# Altium schematic sheet Hammerhead - USB R1.1.SchDoc
size A; SheetNumber: 6
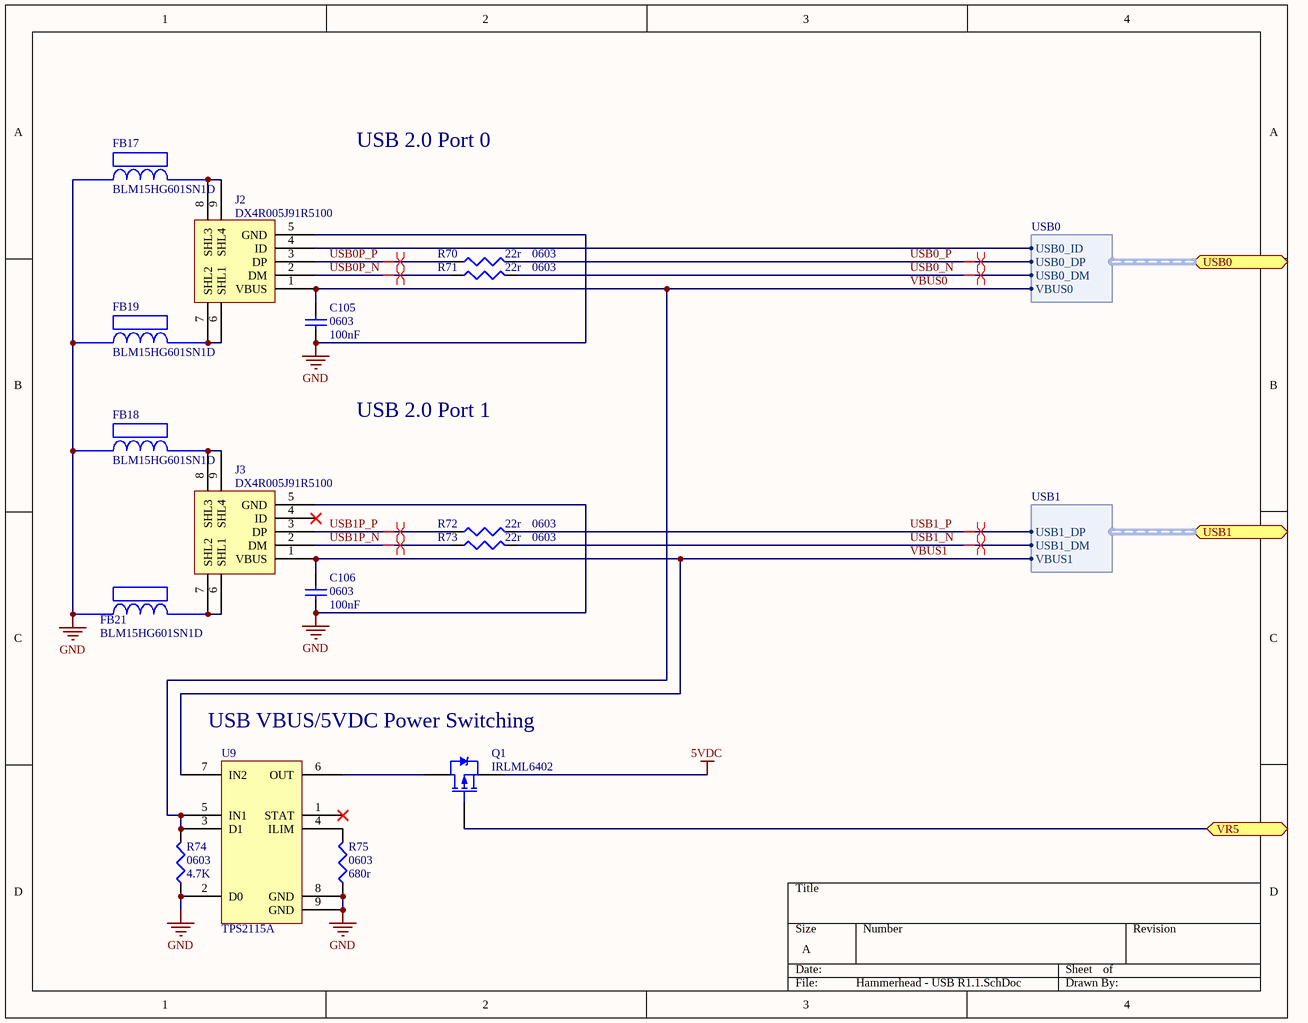
[diagram p0: Hammerhead - USB R1.1.SchDoc]

## Parts
C105  0603  value 100nF  [1608[0603]]
C106  0603  value 100nF  [1608[0603]]
FB17  BLM15HG601SN1D  [BLM18PG121SN1D]
FB18  BLM15HG601SN1D  [BLM18PG121SN1D]
FB19  BLM15HG601SN1D  [BLM18PG121SN1D]
FB21  BLM15HG601SN1D  [BLM18PG121SN1D]
J2  DX4R005J91R5100  [Micro USB Circular Holes Only]
J3  DX4R005J91R5100  [Micro USB Circular Holes Only]
Q1  IRLML6402  [SOT95P237X112-3N]
R70  0603  value 22r  [J1-0603]
R71  0603  value 22r  [J1-0603]
R72  0603  value 22r  [J1-0603]
R73  0603  value 22r  [J1-0603]
R74  0603  value 4.7K  [J1-0603]
R75  0603  value 680r  [J1-0603]
U9  TPS2115A  [DRB S-PVSON-N8]

## Ports
USB0 (harness USB0), USB1 (harness USB1), VR5

## Harnesses
USB1: VBUS1, USB1_DM, USB1_DP
USB0: USB0_ID, VBUS0, USB0_DM, USB0_DP

## Nets
5VDC: Q1.3(S)
GND: C105.1 C106.1 FB17.1 FB18.1 FB19.1 FB21.1 J2.5(GND) J3.5(GND) R74.1 R75.1 U9.2(D0) U9.8(GND) U9.9(GND)
USB0_N: R71.2 ; port USB0.USB0_DM
USB0_P: R70.2 ; port USB0.USB0_DP
USB0P_N: J2.2(DM) R71.1
USB0P_P: J2.3(DP) R70.1
USB1_N: R73.2 ; port USB1.USB1_DM
USB1_P: R72.2 ; port USB1.USB1_DP
USB1P_N: J3.2(DM) R73.1
USB1P_P: J3.3(DP) R72.1
VBUS0: C105.2 J2.1(VBUS) R74.2 U9.3(D1) U9.5(IN1) ; port USB0.VBUS0
VBUS1: C106.2 J3.1(VBUS) U9.7(IN2) ; port USB1.VBUS1
VR5: Q1.1(G) ; port VR5
NetFB17_2: FB17.2 J2.8(SHL3) J2.9(SHL4)
NetFB18_2: FB18.2 J3.8(SHL3) J3.9(SHL4)
NetFB19_2: FB19.2 J2.6(SHL1) J2.7(SHL2)
NetFB21_2: FB21.2 J3.6(SHL1) J3.7(SHL2)
NetJ2_4: J2.4(ID) ; port USB0.USB0_ID
NetQ1_2: Q1.2(D) U9.6(OUT)
NetR75_2: R75.2 U9.4(ILIM)

Not connected (* = marked no-connect by the designer): J3 4(ID)*; U9 1(STAT)*

## Layout directives
differential pair: USB0_N, USB0_P, USB0P_N, USB0P_P, USB1_N, USB1_P, USB1P_N, USB1P_P

## Notes on the sheet
- USB 2.0 Port 0
- USB 2.0 Port 1
- USB VBUS/5VDC Power Switching

## Library data of the parts
C105 C106 = Cap Semi: Capacitor (Semiconductor SIM Model); Published: 8-Jun-2000; LatestRevisionDate: 29-May-2009; LatestRevisionNote: IPC-7351 Footprint Added.; PackageReference: C1206; Publisher: Altium Limited; PackageDescription: Chip Capacitor
J2 J3 = Micro USB: Micro USB Jack B
Q1 = PMOS-2: P-Channel Power MOSFET; Note: Pin 4 not drawn and electrically connected to Pin 2.; Published: 8-Jun-2000; LatestRevisionDate: 17-Jul-2002; LatestRevisionNote: Re-released for DXP Platform.; DatasheetVersion: PD-9.390D; PackageVersion: Feb-1997; PackageReference: TO-220AB; Publisher: Altium Limited; PackageDescription: TO, Thru-Hole, Vertical, Heatsink Mounted; 3 In-Line Leads; Pitch 2.54 mm; ComponentLink1Description: Manufacturer Link; ComponentLink1URL: http://www.irf.com/
R70-R75 = Res3: Resistor; Published: 8-Jun-2000; LatestRevisionDate: 29-May-2009; LatestRevisionNote: IPC-7351 Footprint Added.; PackageReference: J1-0603; Publisher: Altium Limited; PackageDescription: Chip Resistor